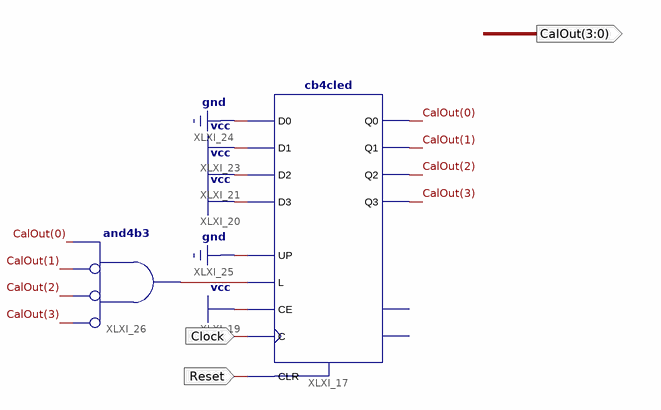
[diagram p0: schematic sheet 1]
// Xilinx ISE schematic dwe4.sch (spartan3) as structural Verilog: 2 symbols, 3 ports
module dwe4 (
  input  Clock,
  input  Reset,
  output [3:0] CalOut
);

  wire XLXN_27;

  cb4cled XLXI_17 (
    .C(Clock), .CE(1'b1), .CLR(Reset), .D0(1'b0), .D1(1'b1), .D2(1'b1), .D3(1'b1), .L(XLXN_27), .UP(1'b0),
    .Q0(CalOut[0]), .Q1(CalOut[1]), .Q2(CalOut[2]), .Q3(CalOut[3]));  // open: CEO, TC
  and XLXI_26 (XLXN_27, ~CalOut[3], ~CalOut[2], ~CalOut[1], CalOut[0]);  // and4b3
endmodule
